# Altium schematic sheet MINI_BLDC_DRV_MCU.SchDoc
size A4
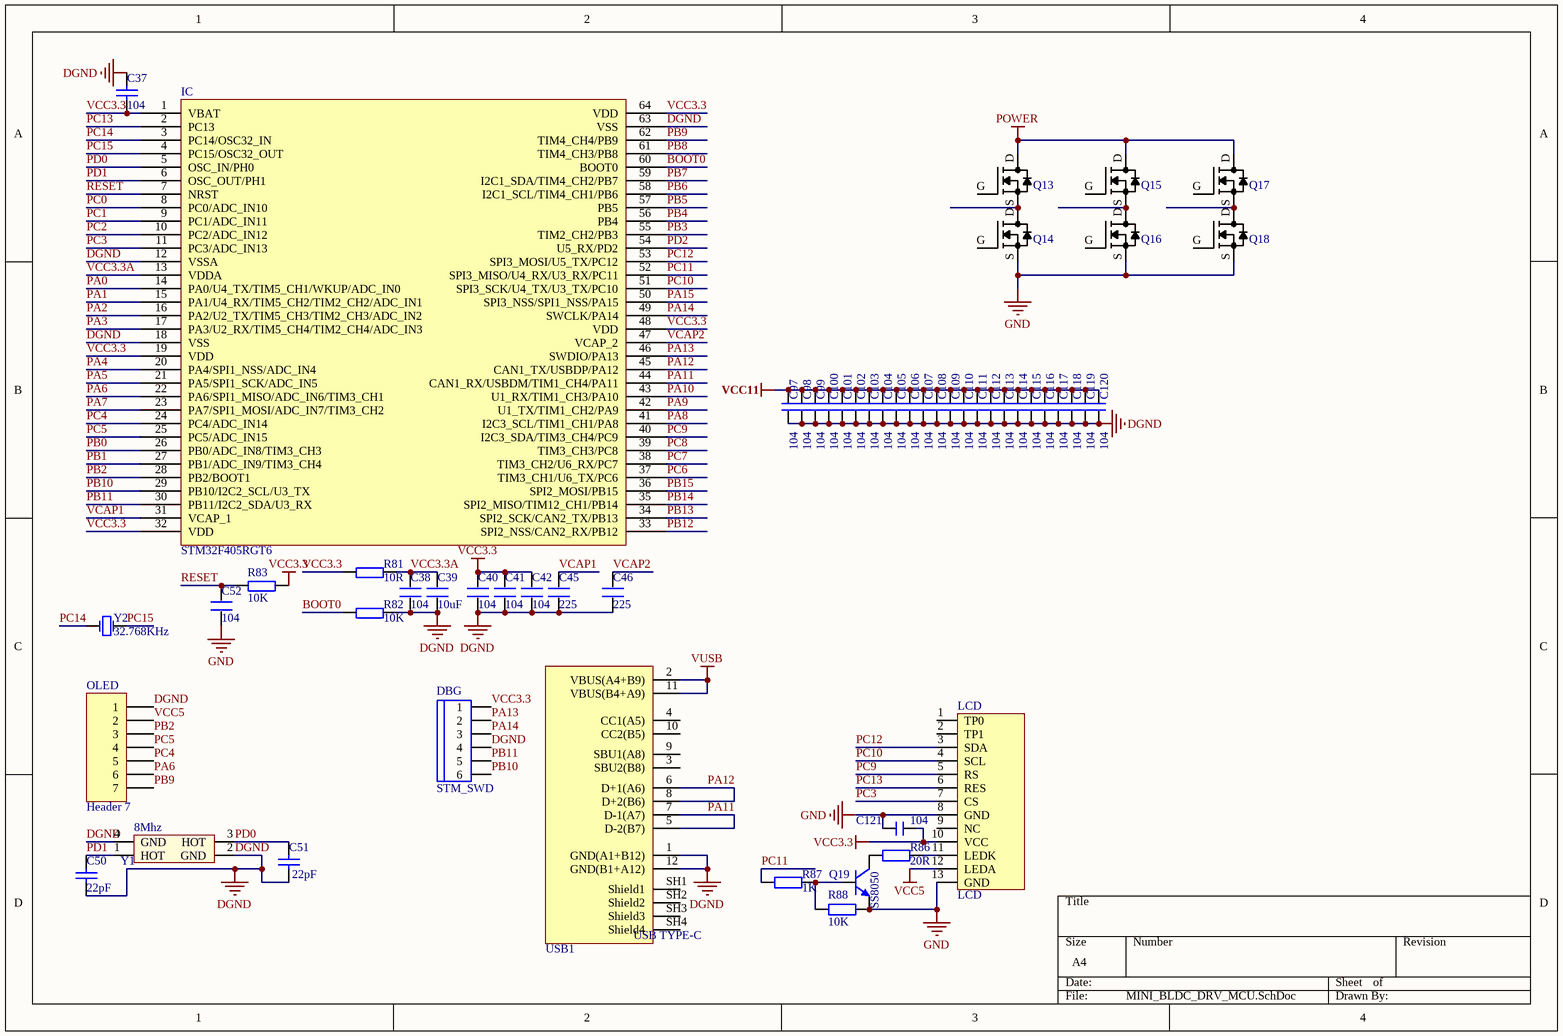
[diagram p0: MINI_BLDC_DRV_MCU.SchDoc]

## Parts
C37  104  [C 0603_L]
C38  104  [C 0603_L]
C39  10uF  [C 0603_L]
C40  104  [C 0603_L]
C41  104  [C 0603_L]
C42  104  [C 0603_L]
C45  225  [C 0603_L]
C46  225  [C 0603_L]
C50  22pF  [C 0603_L]
C51  22pF  [C 0603_L]
C52  104  [C 0603_L]
C97  104  [C 0805_L]
C98  104  [C 0805_L]
C99  104  [C 0805_L]
C100  104  [C 0805_L]
C101  104  [C 0805_L]
C102  104  [C 0805_L]
C103  104  [C 0805_L]
C104  104  [C 0805_L]
C105  104  [C 0805_L]
C106  104  [C 0805_L]
C107  104  [C 0805_L]
C108  104  [C 0805_L]
C109  104  [C 0805_L]
C110  104  [C 0805_L]
C111  104  [C 0805_L]
C112  104  [C 0805_L]
C113  104  [C 0805_L]
C114  104  [C 0805_L]
C115  104  [C 0805_L]
C116  104  [C 0805_L]
C117  104  [C 0805_L]
C118  104  [C 0805_L]
C119  104  [C 0805_L]
C120  104  [C 0805_L]
C121  104  [C 0603_L]
DBG  STM_SWD  [SH1.0_6P]
IC  STM32F405RGT6  [LQFP64 10X10_L]
LCD  LCD  [0.96LCD]
OLED  Header 7  [HDR2.54-M-LI-7P]
Q13  NTMFS5C628NLT  [SO_8FL_DFN5]  (value not drawn)
Q14  NTMFS5C628NLT  [SO_8FL_DFN5]  (value not drawn)
Q15  NTMFS5C628NLT  [SO_8FL_DFN5]  (value not drawn)
Q16  NTMFS5C628NLT  [SO_8FL_DFN5]  (value not drawn)
Q17  NTMFS5C628NLT  [SO_8FL_DFN5]  (value not drawn)
Q18  NTMFS5C628NLT  [SO_8FL_DFN5]  (value not drawn)
Q19  SS8050  [SOT23-3L]
R81  10R  [R 0603_L]
R82  10K  [R 0603_L]
R83  10K  [R 0603_L]
R86  20R  [R 0603_L]
R87  1K  [R 0603_L]
R88  10K  [R 0603_L]
USB1  USB TypeC  [USB Type-C]  (value not drawn)
Y1  8Mhz  [XTAL-3225]
Y2  32.768KHz  [OSC 3215-2P]

## Nets
DGND: C37.1 C38.1 C39.1 C40.1 C41.1 C42.1 C45.1 C46.1 C50.1 C51.1 C97.2 C98.2 C99.2 C100.2 C101.2 C102.2 C103.2 C104.2 C105.2 C106.2 C107.2 C108.2 C109.2 C110.2 C111.2 C112.2 C113.2 C114.2 C115.2 C116.2 C117.2 C118.2 C119.2 C120.2 DBG.4 IC.12(VSSA) IC.18(VSS) IC.63(VSS) OLED.1 R82.2 USB1.1(GND(A1+B12)) USB1.12(GND(B1+A12)) Y1.2(GND) Y1.4(GND)
GND: C52.1 C121.2 LCD.8(GND) LCD.13(GND) Q14.S Q16.S Q18.S Q19.2(E) R88.2
POWER: Q13.D Q15.D Q17.D
VCC3.3: C37.2 C40.2 C41.2 C42.2 C121.1 DBG.1 IC.1(VBAT) IC.19(VDD) IC.32(VDD) IC.48(VDD) IC.64(VDD) LCD.10(VCC) R81.1 R83.2
VCC5: LCD.12(LEDA) OLED.2
VCC11: C97.1 C98.1 C99.1 C100.1 C101.1 C102.1 C103.1 C104.1 C105.1 C106.1 C107.1 C108.1 C109.1 C110.1 C111.1 C112.1 C113.1 C114.1 C115.1 C116.1 C117.1 C118.1 C119.1 C120.1
VUSB: USB1.2(VBUS(A4+B9)) USB1.11(VBUS(B4+A9))
BOOT0: IC.60(BOOT0) R82.1
PA0: IC.14(PA0/U4_TX/TIM5_CH1/WKUP/ADC_IN0)
PA1: IC.15(PA1/U4_RX/TIM5_CH2/TIM2_CH2/ADC_IN1)
PA2: IC.16(PA2/U2_TX/TIM5_CH3/TIM2_CH3/ADC_IN2)
PA3: IC.17(PA3/U2_RX/TIM5_CH4/TIM2_CH4/ADC_IN3)
PA4: IC.20(PA4/SPI1_NSS/ADC_IN4)
PA5: IC.21(PA5/SPI1_SCK/ADC_IN5)
PA6: IC.22(PA6/SPI1_MISO/ADC_IN6/TIM3_CH1) OLED.6
PA7: IC.23(PA7/SPI1_MOSI/ADC_IN7/TIM3_CH2)
PA8: IC.41(I2C3_SCL/TIM1_CH1/PA8)
PA9: IC.42(U1_TX/TIM1_CH2/PA9)
PA10: IC.43(U1_RX/TIM1_CH3/PA10)
PA11: IC.44(CAN1_RX/USBDM/TIM1_CH4/PA11) USB1.5(D-2(B7)) USB1.7(D-1(A7))
PA12: IC.45(CAN1_TX/USBDP/PA12) USB1.6(D+1(A6)) USB1.8(D+2(B6))
PA13: DBG.2 IC.46(SWDIO/PA13)
PA14: DBG.3 IC.49(SWCLK/PA14)
PA15: IC.50(SPI3_NSS/SPI1_NSS/PA15)
PB0: IC.26(PB0/ADC_IN8/TIM3_CH3)
PB1: IC.27(PB1/ADC_IN9/TIM3_CH4)
PB2: IC.28(PB2/BOOT1) OLED.3
PB3: IC.55(TIM2_CH2/PB3)
PB4: IC.56(PB4)
PB5: IC.57(PB5)
PB6: IC.58(I2C1_SCL/TIM4_CH1/PB6)
PB7: IC.59(I2C1_SDA/TIM4_CH2/PB7)
PB8: IC.61(TIM4_CH3/PB8)
PB9: IC.62(TIM4_CH4/PB9) OLED.7
PB10: DBG.6 IC.29(PB10/I2C2_SCL/U3_TX)
PB11: DBG.5 IC.30(PB11/I2C2_SDA/U3_RX)
PB12: IC.33(SPI2_NSS/CAN2_RX/PB12)
PB13: IC.34(SPI2_SCK/CAN2_TX/PB13)
PB14: IC.35(SPI2_MISO/TIM12_CH1/PB14)
PB15: IC.36(SPI2_MOSI/PB15)
PC0: IC.8(PC0/ADC_IN10)
PC1: IC.9(PC1/ADC_IN11)
PC2: IC.10(PC2/ADC_IN12)
PC3: IC.11(PC3/ADC_IN13) LCD.7(CS)
PC4: IC.24(PC4/ADC_IN14) OLED.5
PC5: IC.25(PC5/ADC_IN15) OLED.4
PC6: IC.37(TIM3_CH1/U6_TX/PC6)
PC7: IC.38(TIM3_CH2/U6_RX/PC7)
PC8: IC.39(TIM3_CH3/PC8)
PC9: IC.40(I2C3_SDA/TIM3_CH4/PC9) LCD.5(RS)
PC10: IC.51(SPI3_SCK/U4_TX/U3_TX/PC10) LCD.4(SCL)
PC11: IC.52(SPI3_MISO/U4_RX/U3_RX/PC11) R87.1
PC12: IC.53(SPI3_MOSI/U5_TX/PC12) LCD.3(SDA)
PC13: IC.2(PC13) LCD.6(RES)
PC14: IC.3(PC14/OSC32_IN) Y2.1(OSC1)
PC15: IC.4(PC15/OSC32_OUT) Y2.2(OSC2)
PD0: C51.2 IC.5(OSC_IN/PH0) Y1.3(HOT)
PD1: C50.2 IC.6(OSC_OUT/PH1) Y1.1(HOT)
PD2: IC.54(U5_RX/PD2)
RESET: C52.2 IC.7(NRST) R83.1
VCAP1: C45.2 IC.31(VCAP_1)
VCAP2: C46.2 IC.47(VCAP_2)
VCC3.3A: C38.2 C39.2 IC.13(VDDA) R81.2
NetLCD_11: LCD.11(LEDK) R86.2
NetQ13_S: Q13.S Q14.D
NetQ15_S: Q15.S Q16.D
NetQ17_S: Q17.S Q18.D
NetQ19_1: Q19.1(B) R87.2 R88.1
NetQ19_3: Q19.3(C) R86.1

Not connected (* = marked no-connect by the designer): LCD 1(TP0) 2(TP1) 9(NC); Q13 G; Q14 G; Q15 G; Q16 G; Q17 G; Q18 G; USB1 3(SBU2(B8)) 4(CC1(A5)) 9(SBU1(A8)) 10(CC2(B5)) SH1(Shield1) SH2(Shield2) SH3(Shield3) SH4(Shield4)

## Notes on the sheet
- (in symbol USB Type-C) USB TYPE-C

## Library data of the parts
C37 C50 C51 = CAP
C38-C42 C45 C46 C52 = C
C97-C120 = C: 无极性贴片电容; 版权归属: 源创客; BOM名称: 无极性贴片电容; 学习资源: www.ooocke.com
C121 = C: 无极性电容; BOM名称: 无极性贴片电容; 版权归属: 正点原子; 学习资源: www.openedv.com
DBG = HEAD6
IC = STM32F405RGT6: Flaah:256/RAM:48/IO:51
LCD = LCD 0.96: 0.96 LCD 80*160; BOM名称: 12864 点阵屏; 版权归属: 正点原子; Parameter: 显示器件; 学习资源: www.openedv.com
OLED = Header 7: Header, 7-Pin; LatestRevisionDate: 17-Jul-2002; LatestRevisionNote: Re-released for DXP Platform.; Publisher: Altium Limited
Q13-Q18 = NTMFS5C628NLT: MOSFET N-CH 60V SO8FL; Manufacturer: ON Semiconductor; Manufacturer Part Number: NTMFS5C628NLT1G; FET Type: N-Channel; Drive Voltage (Max Rds On,  Min Rds On): 4.5V, 10V; Vgs(th) (Max) @ Id: 2V @ 135µA; Gate Charge (Qg) (Max) @ Vgs: 52nC @ 10V; Input Capacitance (Ciss) (Max) @ Vds: 3600pF @ 25V; Vgs (Max): ±20V; Power Dissipation (Max): 3.7W (Ta), 110W (Tc); Rds On (Max) @ Id, Vgs: 2.4 mOhm @ 50A, 10V; Supplier 1: Digi-Key; Supplier Part Number 1: NTMFS5C628NLT1GOSCT-ND; RoHS: RoHS Compliant; Category: Discrete Semiconductor Products; Stock: 1490; Pricing 1: 1=1.8, 10=1.627, 100=1.3078, 500=1.01716 (USD); Packaging: Cut Tape (CT); Part Status: Active; Technology: MOSFET (Metal Oxide); Current - Continuous Drain (Id) @ 25°C: -; FET Feature: -; Operating Temperature: -55°C ~ 175°C (TJ); Mounting Type: Surface Mount; Supplier Device Package: 5-DFN (5x6) (8-SOFL); Package / Case: 8-PowerTDFN; ComponentLink1URL: http://www.onsemi.com/pub/Collateral/NTMFS5C628NL-D.PDF; ComponentLink1Description: http://www.onsemi.com/pub/Collateral/NTMFS5C628NL-D.PDF; Supplier 2: Digi-Key; Supplier Part Number 2: NTMFS5C628NLT1GOSTR-ND; Pricing 2: 1500=0.81823 (USD)
Q19 = 8050-SMD: 高频放大-NPN型; 版权归属: 正点原子; 属性: 40V 1.5A 1W 100MHZ; Parameter: 三极管; BOM名称: 高频放大-NPN型; 学习资源: www.openedv.com
R81-R83 = R
R86-R88 = R: 贴片电阻
USB1 = USB Type-C: TypeC座12P
Y1 = XTAL_3225: 3225贴片无源晶振
Y2 = XTAL: 普通晶振; Published: 8-Jun-2000; LatestRevisionDate: 17-Jul-2002; LatestRevisionNote: Re-released for DXP Platform.; Publisher: Altium Limited